# EasyEDA schematic SCH_Adamjames_2023-03-12.json
TITLE: Schema; REV: 1.0; Date: 2023-03-12; Sheet: 1/1; Drawn By: DaOfficialWizard; Company: Prometheon Technologies
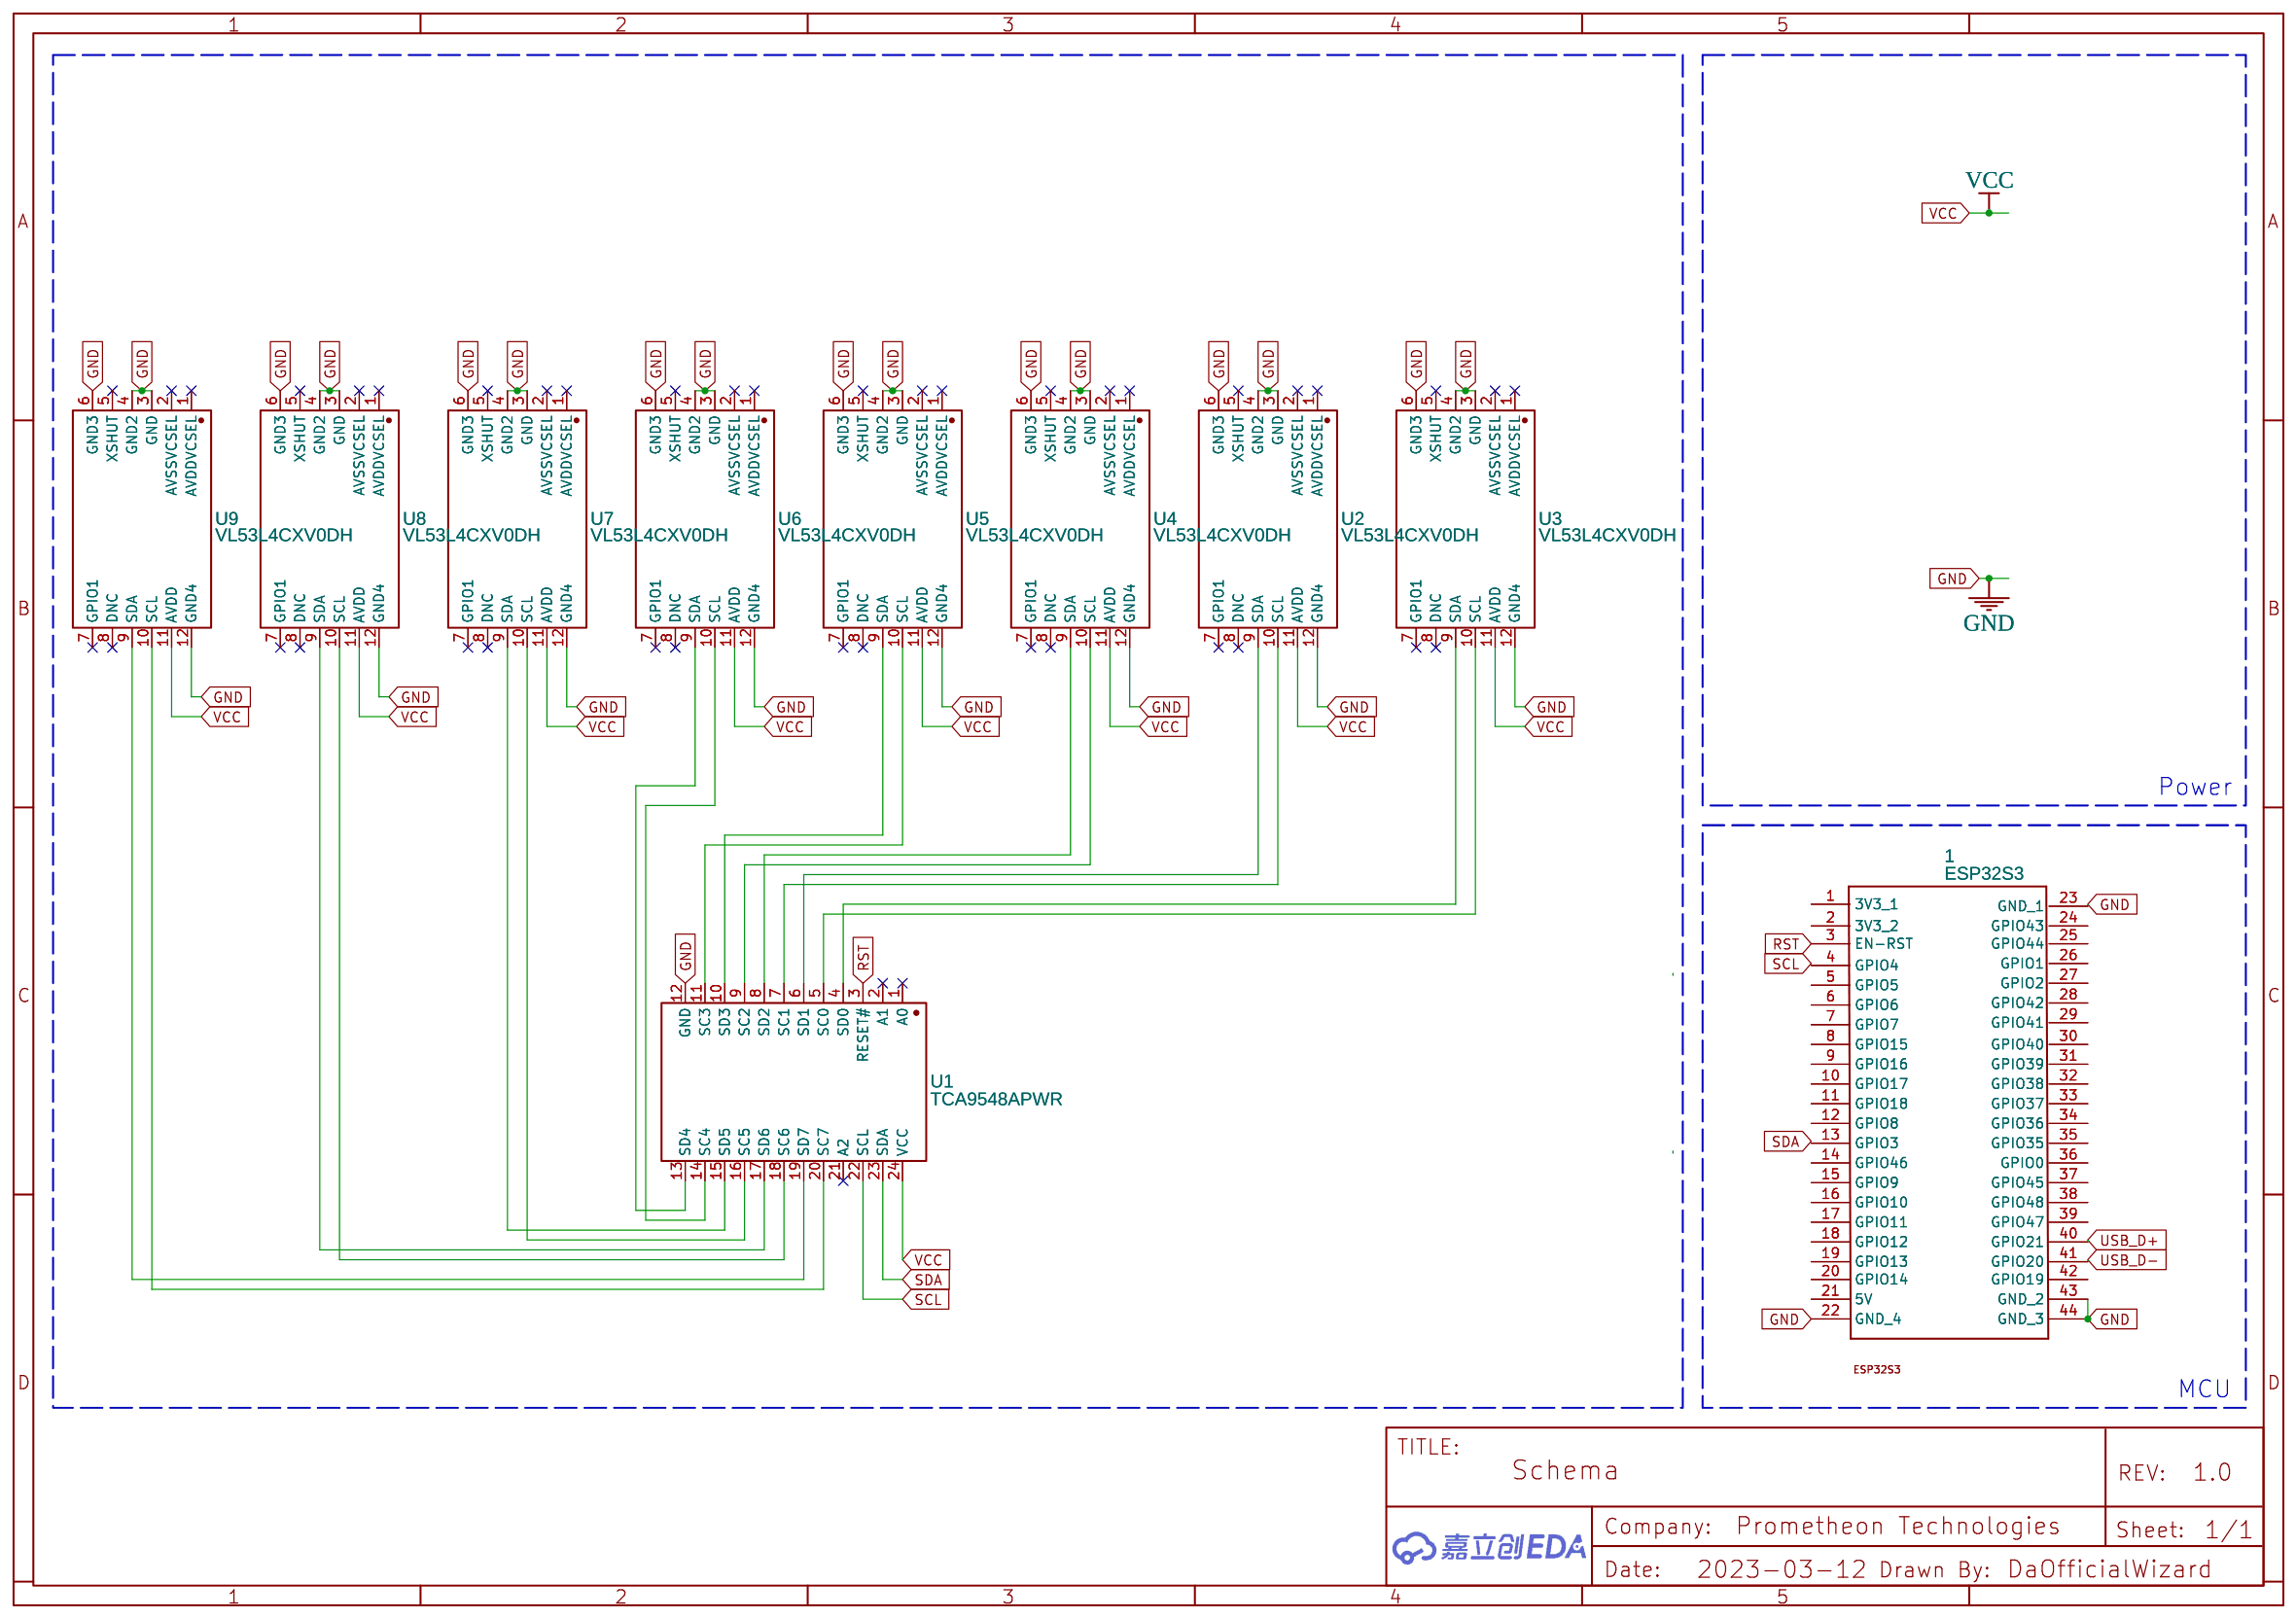
[diagram p0: schematic sheet]

## Parts
1  ESP32S3  [ESP32S-NODEMCU]
U1  TCA9548APWR  [TSSOP-24_L7.8-W4.4-P0.65-LS6.4-BL]
U2  VL53L4CXV0DH  [LGA-12_L4.4-W2.4_VL53L0X]
U3  VL53L4CXV0DH  [LGA-12_L4.4-W2.4_VL53L0X]
U4  VL53L4CXV0DH  [LGA-12_L4.4-W2.4_VL53L0X]
U5  VL53L4CXV0DH  [LGA-12_L4.4-W2.4_VL53L0X]
U6  VL53L4CXV0DH  [LGA-12_L4.4-W2.4_VL53L0X]
U7  VL53L4CXV0DH  [LGA-12_L4.4-W2.4_VL53L0X]
U8  VL53L4CXV0DH  [LGA-12_L4.4-W2.4_VL53L0X]
U9  VL53L4CXV0DH  [LGA-12_L4.4-W2.4_VL53L0X]

## Library data of the parts
1 = ESP32S3: Contributor: maxime98
U1 = TCA9548APWR: Supplier: LCSC; Manufacturer: TI(德州仪器); Supplier Part: C130026; JLCPCB Part Class: Extended Part
U2-U9 = VL53L4CXV0DH: Supplier: LCSC; Supplier Part: C2929940; Manufacturer Part: VL53L0X; JLCPCB Part Class: Extended Part; Contributor: LCSC

## Nets
GND: 1.22(GND_4) 1.23(GND_1) 1.43(GND_2) 1.44(GND_3) U1.12(GND) U2.3(GND) U2.4(GND2) U2.6(GND3) U2.12(GND4) U3.3(GND) U3.4(GND2) U3.6(GND3) U3.12(GND4) U4.3(GND) U4.4(GND2) U4.6(GND3) U4.12(GND4) U5.3(GND) U5.4(GND2) U5.6(GND3) U5.12(GND4) U6.3(GND) U6.4(GND2) U6.6(GND3) U6.12(GND4) U7.3(GND) U7.4(GND2) U7.6(GND3) U7.12(GND4) U8.3(GND) U8.4(GND2) U8.6(GND3) U8.12(GND4) U9.3(GND) U9.4(GND2) U9.6(GND3) U9.12(GND4)
VCC: U1.24(VCC) U2.11(AVDD) U3.11(AVDD) U4.11(AVDD) U5.11(AVDD) U6.11(AVDD) U7.11(AVDD) U8.11(AVDD) U9.11(AVDD)
RST: 1.3(EN-RST) U1.3(RESET#)
SCL: U1.22(SCL)
SDA: U1.23(SDA)
USB_D+: 1.40(GPIO21)
USB_D-: 1.41(GPIO20)
Net-(U1-4): U1.4(SD0) U3.9(SDA)
Net-(U1-5): U1.5(SC0) U3.10(SCL)
Net-(U1-6): U1.6(SD1) U2.9(SDA)
Net-(U1-7): U1.7(SC1) U2.10(SCL)
Net-(U1-8): U1.8(SD2) U4.9(SDA)
Net-(U1-9): U1.9(SC2) U4.10(SCL)
Net-(U1-10): U1.10(SD3) U5.9(SDA)
Net-(U1-11): U1.11(SC3) U5.10(SCL)
Net-(U1-13): U1.13(SD4) U6.9(SDA)
Net-(U1-14): U1.14(SC4) U6.10(SCL)
Net-(U1-15): U1.15(SD5) U7.9(SDA)
Net-(U1-16): U1.16(SC5) U7.10(SCL)
Net-(U1-17): U1.17(SD6) U8.9(SDA)
Net-(U1-18): U1.18(SC6) U8.10(SCL)
Net-(U1-19): U1.19(SD7) U9.9(SDA)
Net-(U1-20): U1.20(SC7) U9.10(SCL)

Not connected (* = marked no-connect by the designer): 1 1(3V3) 2(3V3) 4(GPIO4) 5(GPIO5) 6(GPIO6) 7(GPIO7) 8(GPIO15) 9(GPIO16) 10(GPIO17) 11(GPIO18) 12(GPIO8) 13(GPIO3) 14(GPIO46) 15(GPIO9) 16(GPIO10) 17(GPIO11) 18(GPIO12) 19(GPIO13) 20(GPIO14) 21(5V) 24(GPIO43) 25(GPIO44) 26(GPIO1) 27(GPIO2) 28(GPIO42) 29(GPIO41) 30(GPIO40) 31(GPIO39) 32(GPIO38) 33(GPIO37) 34(GPIO36) 35(GPIO35) 36(GPIO0) 37(GPIO45) 38(GPIO48) 39(GPIO47) 42(GPIO19); U1 1(A0)* 2(A1)* 21(A2)*; U2 1(AVDDVCSEL)* 2(AVSSVCSEL)* 5(XSHUT)* 7(GPIO1)* 8(DNC)*; U3 1(AVDDVCSEL)* 2(AVSSVCSEL)* 5(XSHUT)* 7(GPIO1)* 8(DNC)*; U4 1(AVDDVCSEL)* 2(AVSSVCSEL)* 5(XSHUT)* 7(GPIO1)* 8(DNC)*; U5 1(AVDDVCSEL)* 2(AVSSVCSEL)* 5(XSHUT)* 7(GPIO1)* 8(DNC)*; U6 1(AVDDVCSEL)* 2(AVSSVCSEL)* 5(XSHUT)* 7(GPIO1)* 8(DNC)*; U7 1(AVDDVCSEL)* 2(AVSSVCSEL)* 5(XSHUT)* 7(GPIO1)* 8(DNC)*; U8 1(AVDDVCSEL)* 2(AVSSVCSEL)* 5(XSHUT)* 7(GPIO1)* 8(DNC)*; U9 1(AVDDVCSEL)* 2(AVSSVCSEL)* 5(XSHUT)* 7(GPIO1)* 8(DNC)*

## Notes on the sheet
- Power
- MCU
